# EAGLE schematic tank (EAGLE 9.0.1)
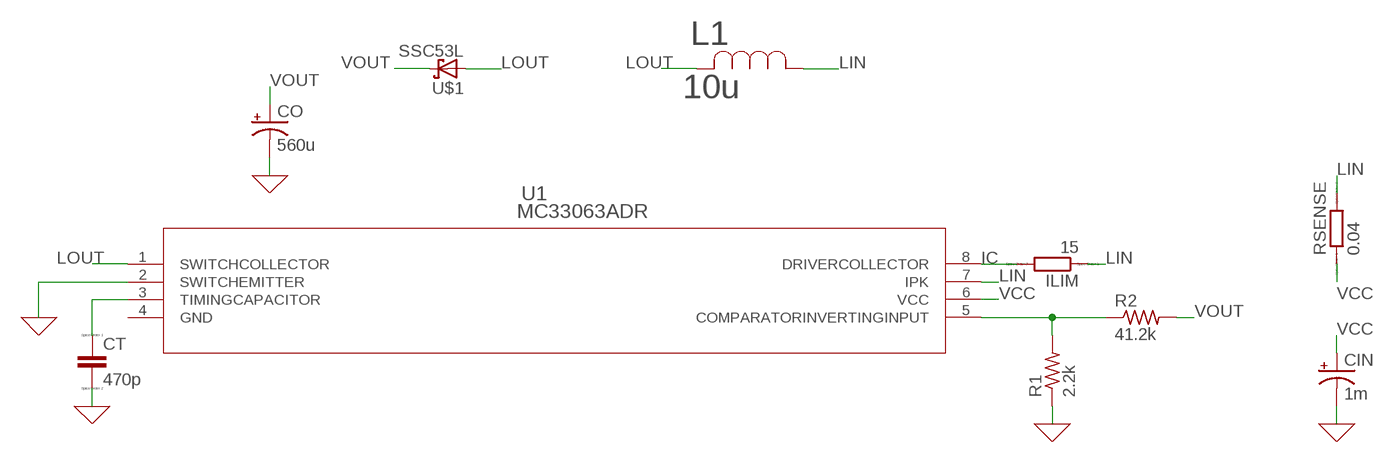
[diagram p0: schematic, sheet 1]

## Parts
CIN  1m  CPOL-USE3.5-10  [E3,5-10]
CO  560u  CPOL-USE5-13  [E5-13]
CT  470p  CC0402  [C0402]
ILIM  15  RR0603  [R0603]
L1  10u  AIUR-06-100K  [AIUR-06]
R1  2.2k  R-US_R0402  [R0402]
R2  41.2k  R-US_R0805  [R0805]
RSENSE  0.04  RR2010  [R2010]
U1  MC33063ADR  [D8]
U$1  SSC53L  [DO-214AB]

## Nets
0: CIN.- CO.- CT.2 R1.1 U1.2(SWITCHEMITTER) ; supply symbol labelled GND
IC: ILIM.2 U1.8(DRIVERCOLLECTOR)
LIN: ILIM.1 L1.1 RSENSE.2 U1.7(IPK)
LOUT: L1.2 U1.1(SWITCHCOLLECTOR) U$1.2(A)
N$1: R1.2 R2.1 U1.5(COMPARATORINVERTINGINPUT)
N$2: CT.1 U1.3(TIMINGCAPACITOR)
VCC: CIN.+ RSENSE.1 U1.6(VCC)
VOUT: CO.+ R2.2 U$1.1(C)
Unconnected: U1.4(GND)

## Library data of the parts
CIN = rcl:CPOL-US: POLARIZED CAPACITOR, American symbol; MANUFACTURER_PART_NUMBER: ECA-1EM102; SPICEPREFIX: C
CO = rcl:CPOL-US: POLARIZED CAPACITOR, American symbol; MANUFACTURER_PART_NUMBER: EEU-FC1V561S; SPICEPREFIX: C
CT = eagle-ltspice:C: CAPACITOR, European symbol; MANUFACTURER_PART_NUMBER: GRM155R71H471KA01D; SPICEMODEL: NONE; SPICEPREFIX: C
ILIM RSENSE = tank:R: RESISTOR, European symbol; MANUFACTURER_PART_NUMBER: CSRN2010FK40L0CT-ND; SPICEMODEL: NONE; SPICEPREFIX: R
L1 = tank:AIUR-06-100K; MANUFACTURER_PART_NUMBER: AIUR06100K; VENDOR: Abracon
R1 = resistor:R-US_: RESISTOR, American symbol; MANUFACTURER_PART_NUMBER: ERJ-2RKF2201X
R2 = resistor:R-US_: RESISTOR, American symbol; MANUFACTURER_PART_NUMBER: RC0805FR-0741K2L
U1 = tank:MC33063ADR; MANUFACTURER_PART_NUMBER: MC33063ADR; VENDOR: Texas Instruments
U$1 = tank:SSC53L; MANUFACTURER_PART_NUMBER: SSC53L-E3/57T